# EAGLE design freeduino_V1.16-0805-WestfW (EAGLE 4.16)
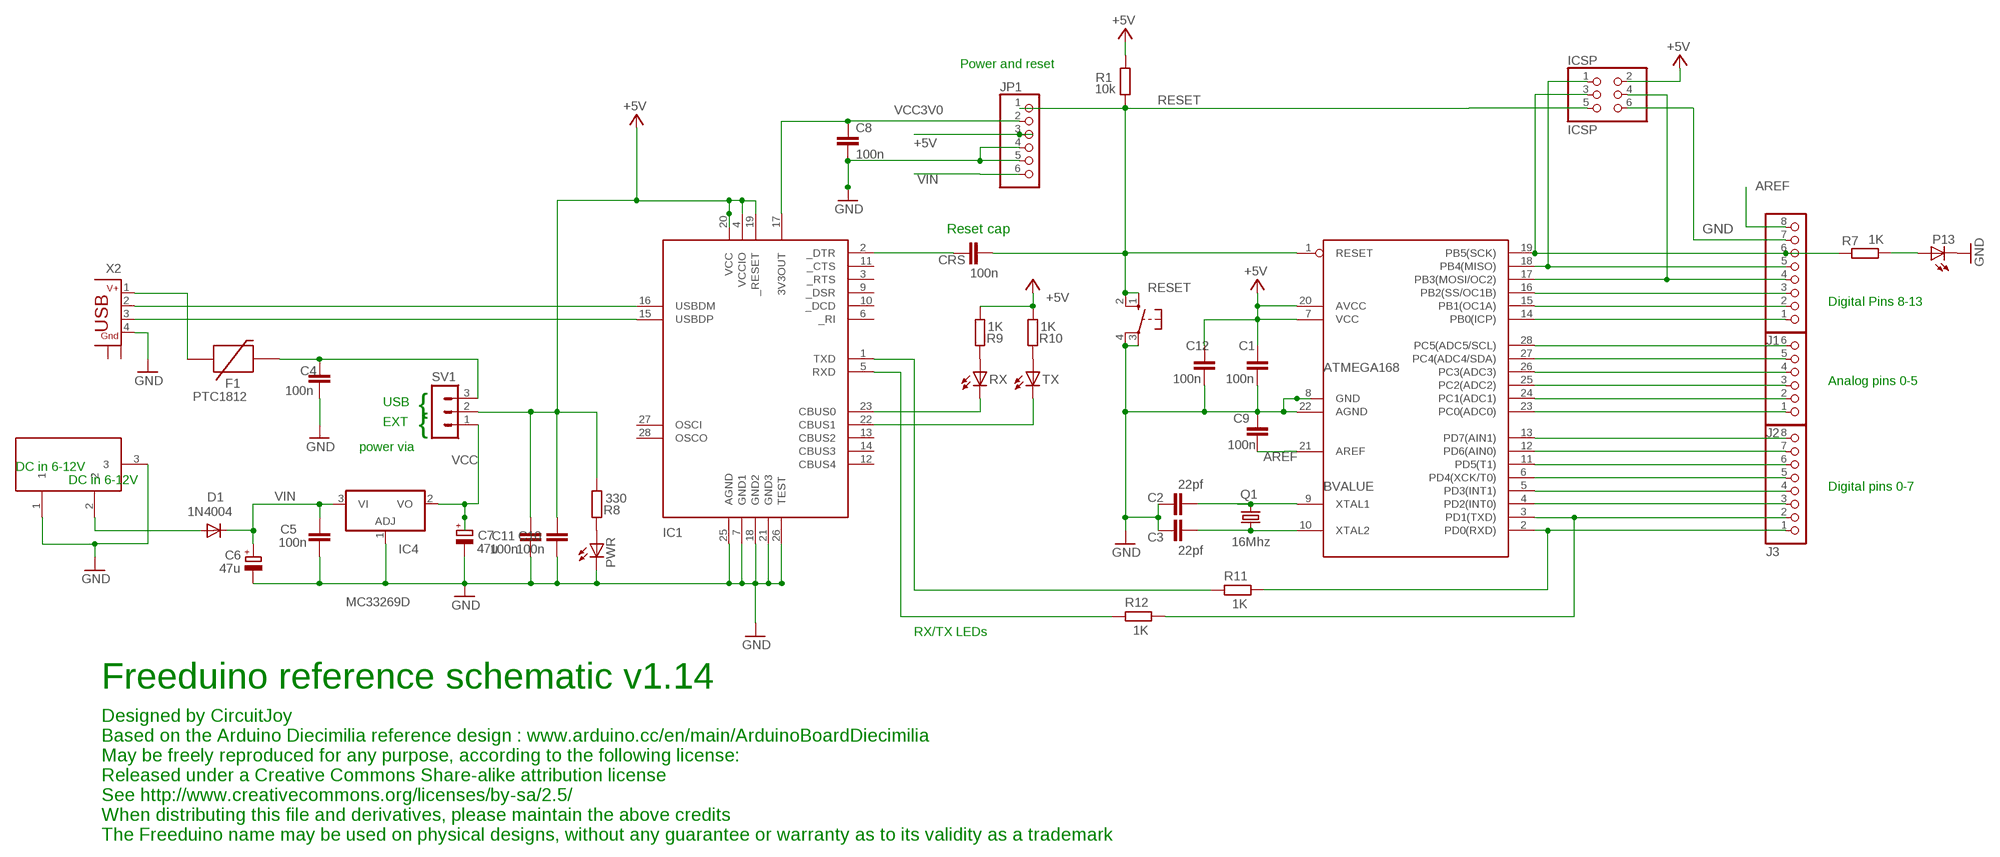
[diagram p0: schematic, sheet 1]

## Parts
BVALUE  ATMEGA168  MEGA8-P  [DIL28-3]
C1  100n  C-EUC0805  [C0805]
C2  22pf  C-EUC0805  [C0805]
C3  22pf  C-EUC0805  [C0805]
C4  100n  C-EUC0805  [C0805]
C5  100n  C-EUC0805  [C0805]
C6  47u  CPOL-EUD  [PANASONIC_D]
C7  47u  CPOL-EUD  [PANASONIC_D]
C8  100n  C-EUC0805  [C0805]
C9  100n  C-EUC0805  [C0805]
C10  100n  C-EUC0805  [C0805]
C11  100n  C-EUC1206  [C1206]
C12  100n  C-EUC0805  [C0805]
CRS  100n  C-EUC0805  [C0805]
D1  1N4004  DIODESMA  [SMA-DIODE]
DC1  9V in  DC21MMX  [DC-21MM]
F1  PTC1812  [C1812]
IC1  FT232RL  FT232RL-PINNED  [SSOP28DB]
IC4  MC33269D  [DPACK]
ICSP  ICSP  PINHD-2X3  [2X03]
J1  PINHD-1X8  [1X08]
J2  PINHD-1X6  [1X06]
J3  PINHD-1X8  [1X08]
JP1  PINHD-1X6  [1X06]
P13  LEDCHIPLED_0805  [CHIPLED_0805]
PWR  LEDCHIPLED_0805  [CHIPLED_0805]
Q1  16Mhz  CRYSTALHC49U-V  [HC49U-V]
R1  10k  R-EU_R0805  [R0805]
R7  1K  R-EU_R0805  [R0805]
R8  330  R-EU_R0805  [R0805]
R9  1K  R-EU_R0805  [R0805]
R10  1K  R-EU_R0805  [R0805]
R11  1K  R-EU_R0805  [R0805]
R12  1K  R-EU_R0805  [R0805]
RESET  10-XX  [B3F-10XX]
RX  LEDCHIPLED_0805  [CHIPLED_0805]
SV1  MA03-1  [MA03-1]
TX  LEDCHIPLED_0805  [CHIPLED_0805]
X2  CON-USB-B  [USB-WSHIELDPADS]

## Nets
+5V [power]: BVALUE.7(VCC) BVALUE.20(AVCC) C1.1 C10.2 C11.2 C12.1 IC1.4(VCCIO) IC1.19(_RESET) IC1.20(VCC) ICSP.2 JP1.3 R1.2 R8.1 R9.1 R10.1 SV1.2
AREF: BVALUE.21(AREF) C9.1 J1.8
GND [power]: BVALUE.8(GND) BVALUE.22(AGND) C1.2 C2.1 C3.1 C4.1 C5.1 C6.- C7.- C8.2 C9.2 C10.1 C11.1 C12.2 DC1.1 DC1.3 IC1.7(GND1) IC1.18(GND2) IC1.21(GND3) IC1.25(AGND) IC1.26(TEST) IC4.1(ADJ) ICSP.6 J1.7 JP1.4 JP1.5 P13.C PWR.C RESET.3(P) RESET.4(P1) X2.4
M8RXD [finepitch]: IC1.1(TXD) R11.1
M8TXD [finepitch]: IC1.5(RXD) R12.1
N$2: BVALUE.15(PB1(OC1A)) J1.2
N$3: PWR.A R8.2
N$5 [finepitch]: IC1.23(CBUS0) RX.C
N$6: BVALUE.9(XTAL1) C2.2 Q1.2
N$7 [power]: C4.2 F1.2 SV1.3
N$8: D1.A DC1.2
N$9 [finepitch]: IC1.16(USBDM) X2.2
N$10: BVALUE.4(PD2(INT0)) J3.3
N$11: BVALUE.5(PD3(INT1)) J3.4
N$12: BVALUE.6(PD4(XCK/T0)) J3.5
N$13: BVALUE.11(PD5(T1)) J3.6
N$14: BVALUE.12(PD6(AIN0)) J3.7
N$15: BVALUE.13(PD7(AIN1)) J3.8
N$16: BVALUE.23(PC0(ADC0)) J2.1
N$17: BVALUE.24(PC1(ADC1)) J2.2
N$18: BVALUE.25(PC2(ADC2)) J2.3
N$19: BVALUE.26(PC3(ADC3)) J2.4
N$20: BVALUE.27(PC4(ADC4/SDA)) J2.5
N$21: BVALUE.28(PC5(ADC5/SCL)) J2.6
N$22: BVALUE.3(PD1(TXD)) J3.2 R12.2
N$23: BVALUE.16(PB2(SS/OC1B)) J1.3
N$24 [finepitch]: IC1.15(USBDP) X2.3
N$26: BVALUE.18(PB4(MISO)) ICSP.1 J1.5
N$27 [power]: F1.1 X2.1
N$28: BVALUE.14(PB0(ICP)) J1.1
N$29 [finepitch]: IC1.22(CBUS1) TX.C
N$31: BVALUE.10(XTAL2) C3.2 Q1.1
N$32: P13.A R7.1
N$34: R10.2 TX.A
N$36: R9.2 RX.A
N$37 [finepitch]: CRS.1 IC1.2(_DTR)
N$43: BVALUE.17(PB3(MOSI/OC2)) ICSP.4 J1.4
N$44: BVALUE.2(PD0(RXD)) J3.1 R11.2
RESET: BVALUE.1(RESET) CRS.2 ICSP.5 JP1.1 R1.1 RESET.1(S) RESET.2(S1)
SCK: BVALUE.19(PB5(SCK)) ICSP.3 J1.6 R7.2
VCC [power]: C7.+ IC4.2(VO) SV1.1
VCC3V0 [power]: C8.1 IC1.17(3V3OUT) JP1.2
VIN [power]: C5.2 C6.+ D1.C IC4.3(VI) JP1.6
Unconnected: IC1.3(_RTS) IC1.6(_RI) IC1.9(_DSR) IC1.10(_DCD) IC1.11(_CTS) IC1.12(CBUS4) IC1.13(CBUS2) IC1.14(CBUS3) IC1.27(OSCI) IC1.28(OSCO)

## Notes on the sheet
- Power and reset
- Reset cap
- Digital Pins 8-13
- Analog pins 0-5
- USB
- {
- EXT
- {
- power via
- DC in 6-12V
- DC in 6-12V
- Digital pins 0-7
- RX/TX LEDs
- Freeduino reference schematic v1.14
- Designed by CircuitJoy
- Based on the Arduino Diecimilia reference design : www.arduino.cc/en/main/ArduinoBoardDiecimilia
- May be freely reproduced for any purpose, according to the following license:
- Released under a Creative Commons Share-alike attribution license
- See http://www.creativecommons.org/licenses/by-sa/2.5/
- When distributing this file and derivatives, please maintain the above credits
- The Freeduino name may be used on physical designs, without any guarantee or warranty as to its validity as a trademark

## Power pins joined to a net without a drawn wire
GND: X2.SH1(GND) X2.SH2(GND)

## Library data of the parts
BVALUE = my-library:MEGA8-P: MICROCONTROLLER 8 Kbytes FLASH 1 kbytes SRAM 512 bytes EEPROM USART 4-channel 10 bit ADC 2-channel 8 bit ADC Source: avr.lbr
C1-C5 C8-C12 CRS = rcl:C-EU: CAPACITOR, European symbol
C6 C7 = rcl:CPOL-EU: POLARIZED CAPACITOR, European symbol
D1 = SparkFunEagle-6-6-07:DIODE: Diode These are standard reverse protection diodes and small signal diodes. SMA package can handle up to about 1A. SOD-323 can handle about 200mA. What the SOD-323 package when ordering, there are some mfgs out there that are 5-pin packages.
DC1 = powersupply:DC21MM
F1 = SparkFunEagle-6-6-07:PTC: Resettable Fuse PTC Resettable Fuse. Spark Fun Electronics SKU : COM-08357
IC1 = my-library:FT232RL-PINNED: USB UART FT232RL 4th Generation USB UART (USB <-> Serial) Controller. Spark Fun Electronics SKU : COM-00650
IC4 = linear:MC33269?*: Adjustable Output Low Dropout Voltage Regulator 800 mA Source: http://www.onsemi.com/pub/Collateral/MC33269-D.PDF
ICSP = pinhead:PINHD-2X3: PIN HEADER
J1 J3 = pinhead:PINHD-1X8: PIN HEADER
J2 JP1 = pinhead:PINHD-1X6: PIN HEADER
P13 PWR RX TX = led:LED: LED OSRAM: - CHIPLED LG R971, LG N971, LY N971, LG Q971, LY Q971, LO R971, LY R971 LH N974, LH R974 LS Q976, LO Q976, LY Q976 LO Q996 - Hyper CHIPLED LW Q18S LB Q993, LB Q99A, LB R99A - SideLED LS A670, LO A670, LY A670, LG A670, LP A670 LB A673, LV A673, LT A673, LW A673 LH A674 LY A675 LS A676, LA A676, LO A676, LY A676, LW A676 LS A679, LY A679, LG A679 - Hyper Micro SIDELED® LS Y876, LA Y876, LO Y876, LY Y876 LT Y87S - SmartLED LW L88C, LW L88S LB L89C, LB L89S, LG L890 LS L89K, LO L89K, LY L89K LS L896, LA L896, LO L896, LY L896 - TOPLED LS T670, LO T670, LY T670, LG T670, LP T670 LSG T670, LSP T670, LSY T670, LOP T670, LYG T670 LG T671, LOG T671, LSG T671 LB T673, LV T673, LT T673, LW T673 LH T674 LS T676, LA T676, LO T676, LY T676, LB T676, LH T676, LSB T676, LW T676 LB T67C, LV T67C, LT T67C, LS T67K, LO T67K, LY T67K, LW E67C LS E67B, LA E67B, LO E67B, LY E67B, LB E67C, LV E67C, LT E67C LW T67C LS T679, LY T679, LG T679 LS T770, LO T770, LY T770, LG T770, LP T770 LB T773, LV T773, LT T773, LW T773 LH T774 LS E675, LA E675, LY E675, LS T675 LS T776, LA T776, LO T776, LY T776, LB T776 LHGB T686 LT T68C, LB T68C - Hyper Mini TOPLED® LB M676 - Mini TOPLED Santana® LG M470 LS M47K, LO M47K, LY M47K Source: http://www.osram.convergy.de/
Q1 = crystal:CRYSTAL: CRYSTAL
R1 R7-R12 = rcl:R-EU_: RESISTOR, European symbol
RESET = switch-omron:10-XX: OMRON SWITCH
SV1 = con-lstb:MA03-1: PIN HEADER
X2 = mylib4:CON-USB-B: BERG USB connector

## Net classes
0 default: width 0.254 mm, drill 0.203 mm
1 power: width 0.508 mm, drill 0.305 mm
2 finepitch: width 0.203 mm, drill 0.203 mm

## Board
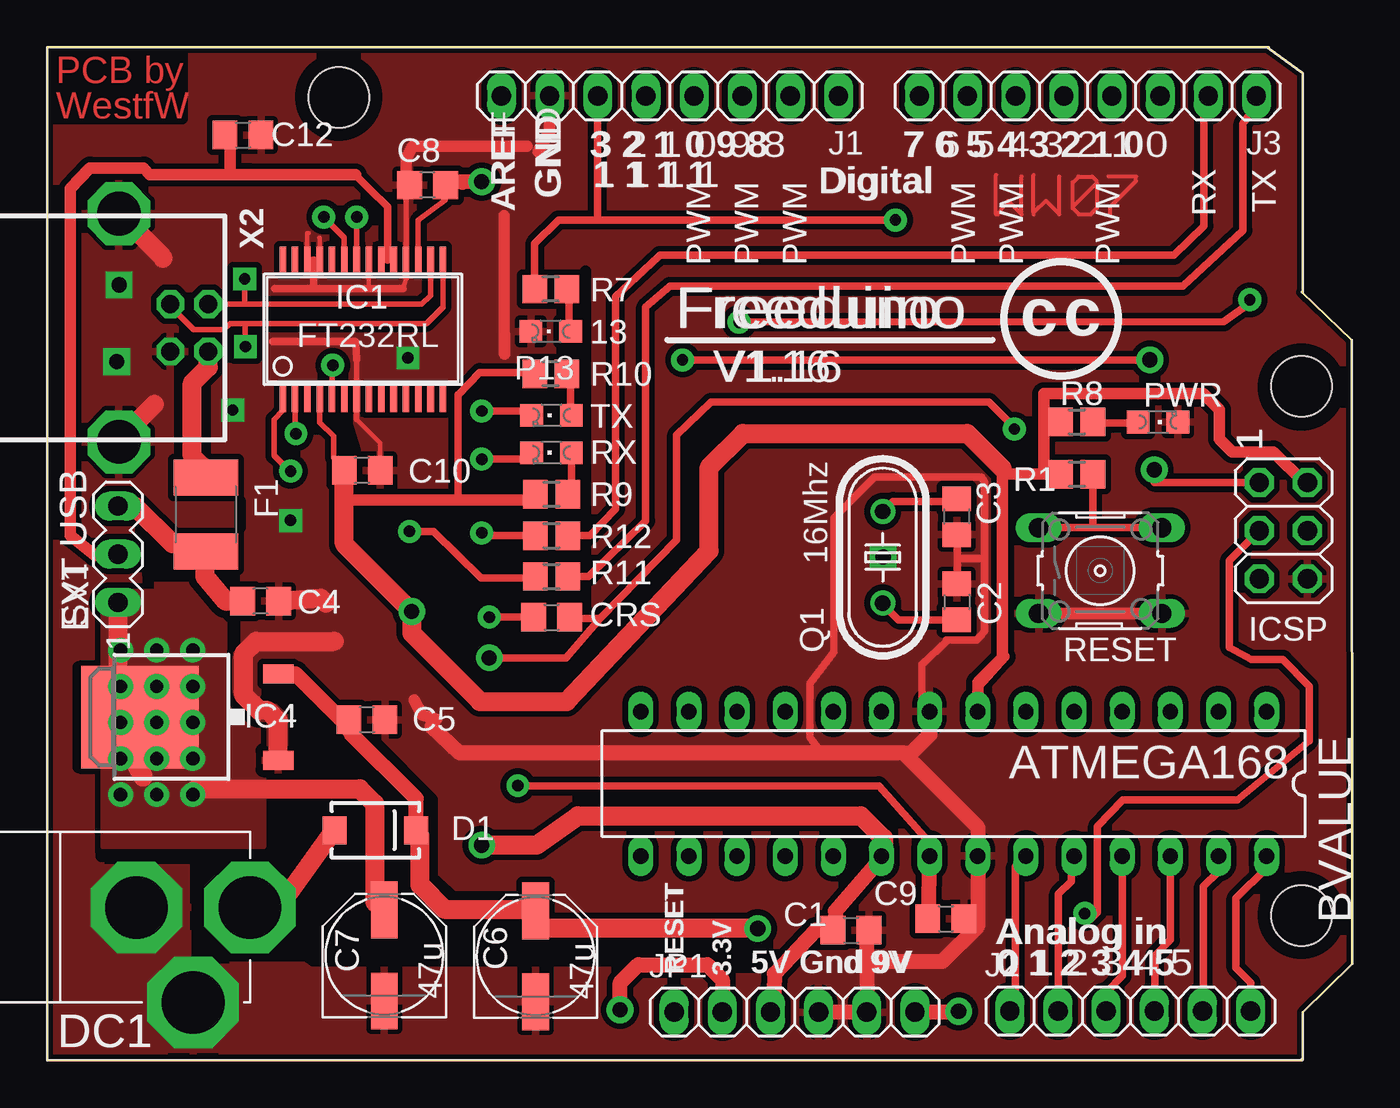
[diagram p1: board, top side]
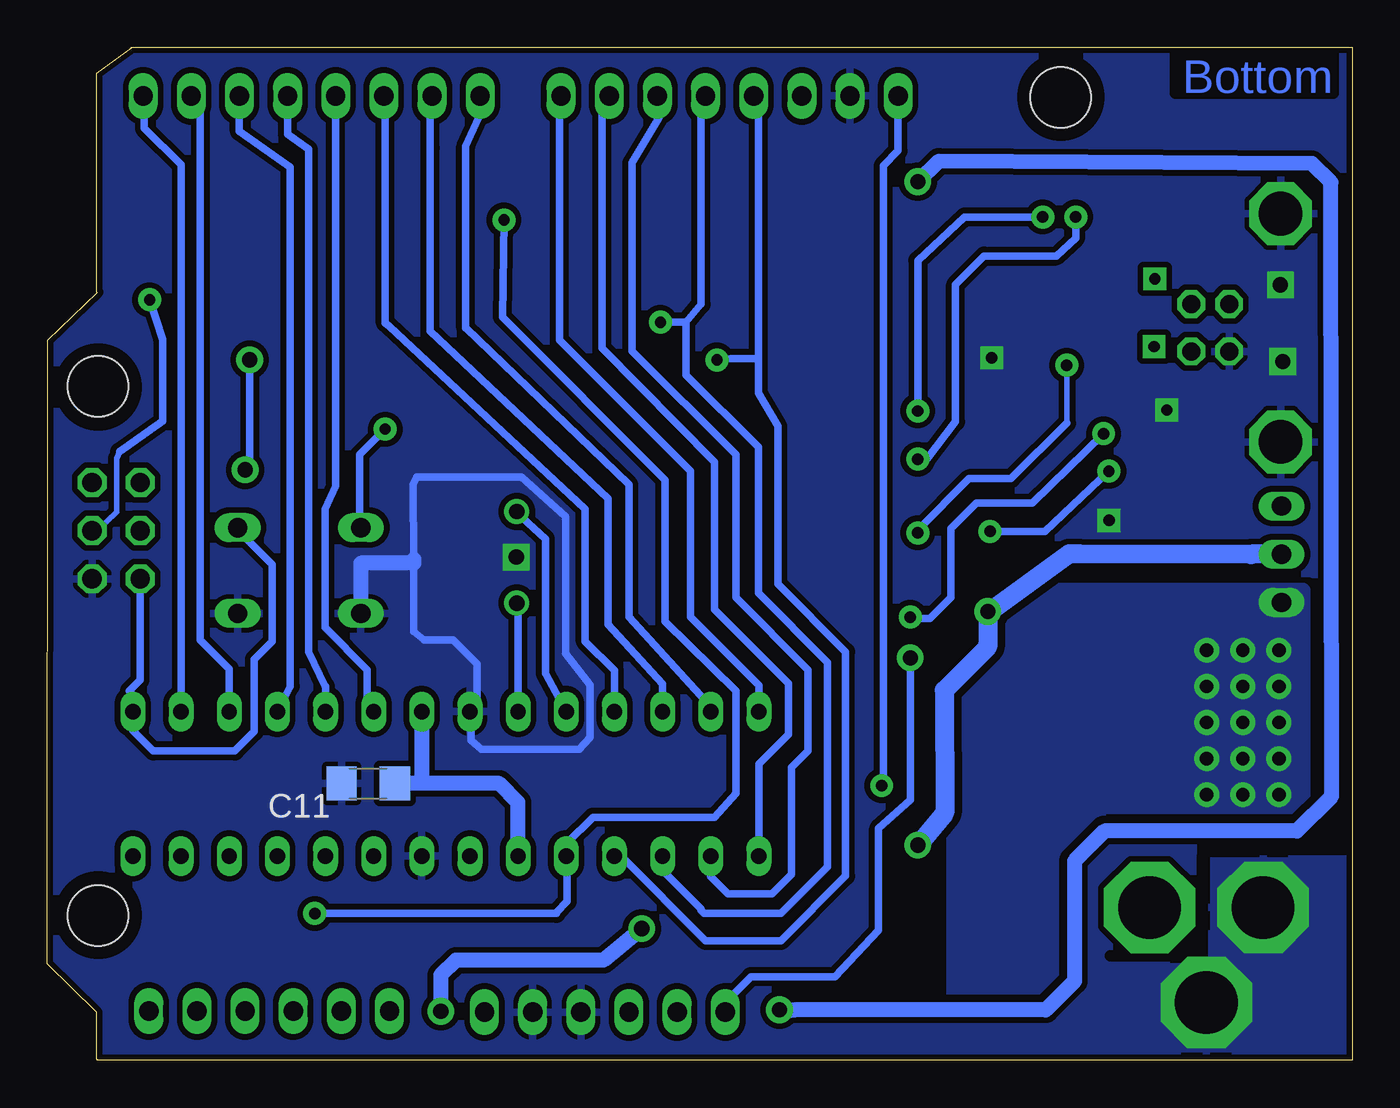
[diagram p2: board, bottom side, seen from below]

Size 68.83 x 53.44 mm. Coordinates in mm from the lower left corner, seen from the top.
Outline: 66.2,0.03 66.22,0.06 66.22,2.55 68.83,5.1
Outline: 66.22,40.54 66.22,52.09 64.39,53.44
Outline: 66.18,0.05 66.2,0 63.63,0.01 0,0.01 0,53.44 64.44,53.44
Outline: 68.83,5.11 68.81,38 66.17,40.54
Copper layers (1*16): Top 0.035mm / dielectric 1.5mm / Bottom 0.035mm
Design rules "default": minimum track width 10mil, minimum drill 0.6mm, track to track 8mil, track to pad 8mil, pad to pad 8mil, via to via 12mil, smd to smd 8mil, copper to edge 10mil, drill to drill 15mil, minimum pad ring 10mil, minimum via ring 12mil, stop-mask expansion 4mil, vias tented up to drill 0mil, thermal gap 10mil
Holes 3.2 mm at 66.17,35.57 66.17,7.63 15.37,50.81
tRestrict: area 13.5,48.9 to 17.3,52.7; area 64.3,33.6 to 68,37.4; area 64.3,5.8 to 68,9.6; 26 lines
bRestrict: area 13.5,48.9 to 17.3,52.7; area 64.3,33.6 to 68,37.4; area 64.3,5.8 to 68,9.6; 3 lines

### Footprints (pad centres in the part's own frame; a part is rotated, then mirrored left to right if it is on the bottom)
DIL28-3 = drill 0.813 long: 1 -16.51,-3.81; 2 -13.97,-3.81; 3 -11.43,-3.81; 4 -8.89,-3.81; 5 -6.35,-3.81; 6 -3.81,-3.81; 7 -1.27,-3.81; 8 1.27,-3.81; 9 3.81,-3.81; 10 6.35,-3.81; 11 8.89,-3.81; 12 11.43,-3.81; 13 13.97,-3.81; 14 16.51,-3.81; 15 16.51,3.81; 16 13.97,3.81; 17 11.43,3.81; 18 8.89,3.81; 19 6.35,3.81; 20 3.81,3.81; 21 1.27,3.81; 22 -1.27,3.81; 23 -3.81,3.81; 24 -6.35,3.81; 25 -8.89,3.81; 26 -11.43,3.81; 27 -13.97,3.81; 28 -16.51,3.81
C0805 = smd 1.3 x 1.5: 1 -0.95,0; 2 0.95,0
PANASONIC_D = smd 3 x 1.4: + 2.4,0; - -2.4,0
C1206 = smd 1.6 x 1.8: 1 -1.4,0; 2 1.4,0
SMA-DIODE = smd 1.27 x 1.47: A -2.15,0; C 2.15,0
DC-21MM = drill 3.302 pad 4.826 octagon: 1 -5.08,-3.353; 2 -0.076,-6.35; 3 -0.076,-0.356
C1812 = smd 1.9 x 3.4: 1 -1.95,0; 2 1.95,0
SSOP28DB = smd 0.348 x 1.397: 1 -4.225,-3.656; 2 -3.575,-3.656; 3 -2.925,-3.656; 4 -2.275,-3.656; 5 -1.625,-3.656; 6 -0.975,-3.656; 7 -0.325,-3.656; 8 0.325,-3.656; 9 0.975,-3.656; 10 1.625,-3.656; 11 2.275,-3.656; 12 2.925,-3.656; 13 3.575,-3.656; 14 4.225,-3.656; 15 4.225,3.656; 16 3.575,3.656; 17 2.925,3.656; 18 2.275,3.656; 19 1.625,3.656; 20 0.975,3.656; 21 0.325,3.656; 22 -0.325,3.656; 23 -0.975,3.656; 24 -1.625,3.656; 25 -2.275,3.656; 26 -2.925,3.656; 27 -3.575,3.656; 28 -4.225,3.656
DPACK = smd 1 x 1.6: 1 -2.28,-4.8; 3 2.28,-4.8 | smd 5.4 x 6.2: 2 0,2.5
2X03 = drill 1.016 octagon: 1 -2.54,-1.27; 2 -2.54,1.27; 3 0,-1.27; 4 0,1.27; 5 2.54,-1.27; 6 2.54,1.27
1X08 = drill 1.016 long: 1 -8.89,0; 2 -6.35,0; 3 -3.81,0; 4 -1.27,0; 5 1.27,0; 6 3.81,0; 7 6.35,0; 8 8.89,0
1X06 = drill 1.016 long: 1 -6.35,0; 2 -3.81,0; 3 -1.27,0; 4 1.27,0; 5 3.81,0; 6 6.35,0
CHIPLED_0805 = smd 1.2 x 1.2: A 0,-1.05; C 0,1.05
HC49U-V = drill 0.813 round: 1 -2.413,0; 2 2.413,0
R0805 = smd 1.3 x 1.5: 1 -0.85,0; 2 0.85,0
B3F-10XX = drill 1.016 long: 1 -3.251,2.261; 2 3.251,2.261; 3 -3.251,-2.261; 4 3.251,-2.261
MA03-1 = drill 1.016 long: 1 -2.54,0; 2 0,0; 3 2.54,0
USB-WSHIELDPADS = drill 0.95 octagon: 1 1.25,4.71; 2 -1.25,4.71; 3 -1.25,2.71; 4 1.25,2.71 | drill 2.3 octagon: SH1 -6.02,0; SH2 6.02,0

### Placement (x,y rotation side)
BVALUE  47.81,14.59 180 top
C1  42.39,6.87 0 top
C2  47.97,24.19 270 top
C3  47.98,28.68 90 top
C4  11.25,24.23 180 top
C5  16.85,17.97 180 top
C6  25.75,5.49 90 top
C7  17.77,5.53 90 top
C8  20.06,46.17 180 top
C9  47.39,7.47 0 top
C10  16.61,31.13 180 top
C11  51.9,14.61 0 bottom
C12  10.32,48.82 0 top
CRS  26.59,23.38 0 top
D1  17.31,12.14 0 top
DC1  4.34,8.14 90 top
F1  8.36,28.81 270 top
IC1  16.64,38.57 0 top
IC4  7.38,18.12 90 top
ICSP  65.2,27.95 270 top
J1  32.84,50.88 180 top
J2  57.12,2.6 0 top
J3  54.89,50.88 180 top
JP1  39.42,2.55 0 top
P13  26.55,38.46 90 top
PWR  58.59,33.68 270 top
Q1  44.07,26.54 270 top
R1  54.3,30.92 180 top
R7  26.55,40.69 180 top
R8  54.3,33.68 0 top
R9  26.59,29.87 0 top
R10  26.55,36.23 0 top
R11  26.59,25.53 0 top
R12  26.59,27.68 0 top
RESET  55.54,25.84 0 top
RX  26.59,32.06 90 top
SV1  3.72,26.7 90 top
TX  26.59,34.04 90 top
U$3  [CC-LOGO]  54.37,39.73 0 top
X2  3.77,38.65 270 top

### Tracks (layer width: path | path; a pad name or v marks a point on that pad's centre or on a via)
+5V  (via drill 0.8)
  Top 0.25: 17.95,42.23 18.2,42.23 18.23,42.26 IC1.19 17.95,42.23 | 17.95,42.23 IC1.20 | SV1.2 3.7,26.72 3.62,26.64 | 17.04,45.92
  Top 0.3: IC1.4 14.36,33.66 15.09,32.94 15.09,31.81 15.66,31.23 C10.2
  Top 0.4: 17.95,42.23 17.95,45.05 17.04,45.92 16.24,46.72 | 25.77,36.29 25.82,36.29 | 25.77,36.29 R10.1 | 25.77,36.29 22.8,36.29 21.68,35.13 21.65,35.13 21.65,29.56 21.63,29.52
  Top 0.6: 9.65,46.72 5.39,46.72 5.09,47.08 2.23,47.08 1.2,45.98 1.2,43.05 1.2,42.79 1.2,27.69 2.51,26.64 3.62,26.64 | 9.65,46.72 10.65,46.72 | 10.65,46.72 16.24,46.72 16.25,46.72 | 49.08,19.78 BVALUE.7 | 49.08,19.78 49.08,19.94 50.37,21.24 50.37,30.92 | 52.56,30.92 53.18,30.92 | 52.56,30.92 52.56,33.82 | 52.56,33.82 52.56,35.17 60.98,35.17 61.82,34.32 61.82,32.78 62.5,32.1 64.68,32.1 66.3,30.49 ICSP.2 | R8.1 53.35,33.78 52.56,33.82 | 53.18,30.92 53.19,30.92 | 53.18,30.92 53.01,31.09 | 49.08,19.78 50.47,21.3 | 10.65,46.72 10.65,46.73 | 50.37,31.23 50.37,30.92 | 50.37,30.92 52.56,30.92 | 52.56,30.92 R1.2 | C12.1 9.65,48.54 9.65,46.72 | 25.74,29.56 25.84,29.56 | 25.74,29.56 R9.1 | 15.66,29.56 21.65,29.56 25.74,29.56
  Top 0.8: JP1.3 38.15,2.51 38.31,2.66 38.35,4.57 40.53,6.87 C1.1 41.54,6.9 41.4,7.03 41.56,7.19 41.56,7.86 44,10.66 BVALUE.20 44,10.81 44.1,10.92 | R1.2
  Top 1: v22.91,11.36 25.83,11.36 27.99,12.9 42.91,12.9 44.1,11.71 44.1,10.92 | 50.37,31.23 48.52,33.08 36.69,33.08 34.91,31.29 34.91,26.89 27.4,18.94 | C10.2 15.66,29.56 15.66,27.24 v19.22,23.69 v19.22,23.68 19.25,23.68 19.29,23.63 19.21,23.55 19.21,22.54 22.82,18.93 27.39,18.93 27.4,18.94 | 27.4,18.94 27.41,18.95
  Bottom 0.8: v22.92,11.36 v22.91,11.36 | C11.2 44.98,14.61 44,13.62 44,10.8 43.97,10.78 | 43.97,10.78 43.96,10.76 | BVALUE.20 43.97,10.78 | BVALUE.7 49.08,14.62
  Bottom 1: v22.92,11.36 21.48,13.06 21.52,19.53 19.22,21.82 19.22,21.94 19.21,21.95 19.22,21.95 v19.22,23.68 19.22,23.62 19.21,23.61 14.94,26.72 14.39,26.72 5.34,26.69 5.33,26.68 5.31,26.7 SV1.2
AREF  (via drill 0.6)
  Top 0.4: v24.82,14.49 43.87,14.49 46.48,11.55 46.48,10.76 46.54,10.71 | 46.54,10.71 46.56,10.68 | 46.54,10.71 BVALUE.21
  Top 0.8: 46.54,10.9 46.54,10.89 BVALUE.21 | 46.54,10.9 C9.1 | 46.54,10.9 46.56,10.92
  Bottom 0.4: J1.8 23.95,47.98 24.74,47.2 24.74,14.57 v24.82,14.49 | v24.82,14.49 24.97,14.57 | v24.82,14.49
GND  (via drill 0.6, 0.8)
  Top 0.2: 50.04,46.7 50.04,44.64 50.12,44.64 50.68,45.35 51.39,44.64 51.39,46.62 | 52.02,44.72 52.02,46.7 | 52.02,44.72 52.02,44.64 | 52.66,45.35 52.02,44.72 | 52.66,45.35 | 52.66,45.35 53.37,44.64 53.37,46.62 | 55.99,46.62 57.42,46.62 57.42,46.39 | 57.42,46.39 | 57.42,46.39 56.07,45.04 56.07,44.64 | 54.09,44.96 54.09,46.31 54.41,46.62 55.12,46.62 55.36,46.39 55.36,46.31 | 55.36,46.31 55.36,44.96 55.04,44.64 54.41,44.64 54.09,44.96 | 54.09,44.96 54.09,45.04 55.36,46.31
  Top 0.25: 13.71,42.25 13.71,42.26 | IC1.26 13.71,42.25 | 14.05,42.23 13.74,42.23 13.71,42.25 | 14.05,42.23 IC1.25 14.36,43.4 14.34,43.4 | 18.78,40.71 18.91,41.24 | 14.05,42.23 IC1.26 | IC1.21 16.96,40.71 | 18.91,46.19 18.93,46.18 C8.2 18.88,46.17 18.85,46.14 18.91,46.07 18.91,46.19 | 18.91,46.19 18.86,46.24 | IC1.26 13.71,43.64 13.79,43.64 | 16.31,33.8 17.56,32.56 17.56,31.17 C10.1
  Top 0.3: 16.31,36.97 IC1.7 16.31,33.8 | 18.91,41.24 IC1.18 18.91,46.07
  Top 0.4: 16.31,36.97 16.25,37.91 11.89,37.91 | 11.98,40.71 14.05,40.71 | 14.05,40.71 16.96,40.71 18.78,40.71 | 14.05,40.71 14.05,42.23 | C3.1 48.01,27.67 47.99,27.67 47.99,25.06 | 47.99,25.06 C2.1 | 49.42,26.48 49.42,30.53 49.26,30.76 43.63,30.76 41.48,28.62 41.48,21.56 40.21,19.89 40.21,17.03 40.69,16.4 45.85,16.4 | 49.42,26.48 49.42,22.63 49.02,22.19 47.44,22.19 47.44,22.1 46.14,20.89 46.14,18.98 46.53,18.4 BVALUE.8 | 45.85,16.4 46.01,16.4 46.56,16.95 46.56,18.3 46.56,18.46 | 47.99,25.06 47.99,26.48 49.42,26.48 | 45.77,16.56 45.85,16.56 45.85,16.4
  Top 0.6: 24.11,37.27 24.1,39.49 24.1,44.57 | 25.89,47.95 26.48,49.02 26.48,50.77 | 18.91,46.07 18.91,47.56 19.26,48.23 25.29,48.23 | JP1.5 43.35,2.55 | RESET.3 RESET.4 | 19.33,19.01 19.77,18.22 20.52,17.98
  Top 0.8: 49.08,7.35 49.08,7.08 47.2,5.2 44.5,5.2 | 49.08,7.35 BVALUE.22 49.08,12.3 45.37,16 | 44.5,5.2 43.23,5.28 43.23,5.2 | 43.23,5.2 43.23,2.66 43.31,2.59 43.27,2.55 JP1.5 43.11,2.55 43.07,2.59 43.03,2.55 JP1.4 | 44.5,5.2 43.23,5.2 | C1.2 43.24,6.39 43.23,5.2 | 49.08,7.35 48.95,7.35 48.82,7.47 C9.2 | 45.37,16 45.14,16.24 21.72,16.24 20.27,17.61 | 45.37,16 45.35,16 | 45.37,16 | 46.56,18.3 46.56,17.19 45.37,16
  Top 1: IC4.1 12.18,17.91 11.64,18.45 11.16,18.45 10.37,19.25 10.37,21.47 11,22.1 15.13,22.1 | C4.1 14.43,24.39 14.69,24.13 14.69,24.17 | 3.76,44.68 6.1,42.34 6.1,42.32 | 3.74,32.7 5.64,34.6 | 3.74,32.7 3.82,32.7 3.82,32.67 X2.SH2 | 3.74,32.7 3.7,32.66
  Bottom 0.4: BVALUE.8 46.54,18.65 46.17,19.02 46.17,20.92 47.44,22.19 48.95,22.19 49.5,22.63 49.5,26.45 49.54,30.37 49.34,30.76 43.83,30.76 41.48,28.7 41.48,21.48 40.21,19.81 40.21,17.03 40.77,16.4 45.93,16.4 46.48,16.87 46.48,18.3 46.56,18.38 46.72,18.38
  Bottom 0.8: RESET.3 52.29,26.24 49.5,26.24 49.5,26.45
  other vias: 44.09,26.55 3.78,40.91 3.66,36.86 12.83,28.49 19.02,37.06 9.77,34.3
  pour Top (isolate 0.305, rank 4): -0.9,54.58 -0.9,-0.99 70.46,-0.99 70.46,54.58 -0.9,54.58
  pour Bottom (isolate 0.305, rank 4): -7.05,54.38 -7.01,-0.43 69.82,-0.43 69.82,54.58 -7.01,54.62
  pour Top (isolate 0.4, rank 5, no thermals): 2.11,12.11 2.11,-0.43 11.16,-0.43 11.16,12.11
  pour Bottom (isolate 0.4, rank 6, no thermals): 0.13,10.44 0.13,-0.11 12.83,-0.11 12.83,10.44
M8RXD  (via drill 0.6)
  Top 0.25: 25.69,25.45 25.73,25.41 R11.1
  Top 0.3: IC1.1 12.41,34.27 11.95,33.81 11.95,31.9 12.83,31.03 12.83,31.04 v12.83,31.08
  Top 0.4: v19.1,27.91 19.58,27.91 20.37,27.91 22.87,25.45 25.69,25.45
  Bottom 0.4: v12.83,31.08 16.2,27.91 v19.1,27.91
M8TXD  (via drill 0.6)
  Top 0.3: v15.05,36.68 15.05,36.7 15.05,36.71 15.01,36.67 IC1.5
  Top 0.4: R12.1 23.5,27.68 v22.91,27.83
  Bottom 0.3: 15.05,36.48 15.05,33.62
  Bottom 0.4: v22.91,27.83 22.91,27.99 20.21,30.68 17.99,30.68 15.05,33.62 | v15.05,36.68 15.09,36.56 15.05,36.48
N$2
  Bottom 0.4: BVALUE.15 31.3,15.63 29.74,17.19 29.74,19.89 33.63,23.78 33.63,31.56 39.58,37.59 39.58,50.05 39.66,50.21 39.19,50.68 J1.2 39.14,50.88 39.1,50.92
N$3
  Top 0.4: R8.2 55.37,33.62 57.84,33.62 PWR.A
N$5  (via drill 0.6)
  Top 0.3: IC1.23 15.66,43.41 v14.58,44.5
  Top 0.4: v22.91,31.72 v22.92,31.72 22.92,31.73 25.21,31.73 RX.C
  Bottom 0.25: v14.58,44.5
  Bottom 0.4: v22.91,31.72 22.43,31.72 20.93,33.7 20.93,40.92 19.42,42.43 15.61,42.43 14.58,43.38 v14.58,44.5
N$6
  Top 0.4: Q1.2 44.04,24.1 44.9,23.24 C2.2
  Bottom 0.4: 44.07,24.18 44.1,24.18 | 44.07,24.18 Q1.2 | BVALUE.9 44,24.18 44.07,24.18
N$7
  Top 1: SV1.3 4.62,29.24 6.6,27.26 8.06,27.26 8.36,26.97 F1.2 8.33,26.86 8.3,26.83 8.3,25.52 9.41,24.21 C4.2
N$8
  Top 0.8: 15.16,12.22 D1.A
  Top 1: DC1.2 11.96,8.06 12.79,8.89 15.17,12.23 15.16,12.22
N$9  (via drill 0.6)
  Top 0.3: X2.2 10.41,39.9 | 10.41,39.9 19.75,39.9 20.21,40.36 IC1.16 | 10.41,39.9 v10.41,41.23
N$10
  Bottom 0.4: J3.3 58.7,49.01 56.01,47.11 56.01,19.73 56.67,18.42 56.66,18.43 56.64,18.44 BVALUE.4
N$11
  Bottom 0.4: J3.4 56.16,48.85 55.06,48.07 55.05,21.55 54.18,19.73 54.17,19.73 54.16,19.74 54.16,19.73 BVALUE.5
N$12
  Bottom 0.4: J3.5 53.62,30.3 54.18,29.1 54.18,22.83 51.96,20.6 51.96,19.02 51.97,19.02 | 51.97,19.02 51.98,19.02 | BVALUE.6 51.62,18.38 51.97,19.02
N$13
  Bottom 0.4: BVALUE.11 38.92,20.58 40.45,22.11 40.45,29.1 50.81,38.74 51.01,38.9 51.01,50.77 51.08,50.84 J3.6
N$14
  Bottom 0.4: BVALUE.12 36.38,19.86 39.26,22.98 39.26,29.65 48.63,38.46 48.63,48.15 48.63,49.89 48.55,50.92 48.55,50.85 | 48.54,50.92 J3.7 48.54,50.85 48.55,50.85 | 48.55,50.85
N$15
  Bottom 0.4: BVALUE.13 33.84,18.67 38.15,23.38 38.15,30.37 46.76,38.66 46.76,38.62 46.76,48.23 46.09,49.73 46.09,50.69 46,50.78 J3.8
N$16
  Top 0.4: J2.1 51.07,2.9 51.07,10.23 BVALUE.23
N$17
  Top 0.4: BVALUE.24 54.01,10.63 54.01,9.45 53.33,8.77 53.33,2.58 J2.2
N$18
  Top 0.4: BVALUE.25 56.71,4.45 55.91,3.66 55.91,2.58 55.87,2.58 J2.3
N$19
  Top 0.4: BVALUE.26 59.25,6.35 58.41,5.52 58.41,2.62 J2.4
N$20
  Top 0.4: BVALUE.27 61.78,9.96 60.99,9.17 60.99,3.02 60.93,2.96 J2.5
N$21
  Top 0.4: BVALUE.28 64.32,10.16 62.7,8.54 62.7,4.89 63.49,4.09 63.49,2.62 63.47,2.61 J2.6
N$22
  Top 0.4: R12.2 28.63,27.68 29.97,29.1 29.97,40.29 32.25,42.41 32.32,42.47 59.42,42.47 61.01,44.02 61.01,50.45 61.33,50.77 61.24,50.85 J3.2
  Bottom 0.4: BVALUE.3 59.24,20.66 60.77,22.19 60.77,50.37 61.29,50.88 | 61.29,50.88 61.41,51 | J3.2 61.29,50.88
N$23
  Bottom 0.4: BVALUE.16 33.84,9.7 32.91,8.78 30.61,8.78 29.58,9.81 29.58,15.44 28.7,16.32 28.7,20.6 32.51,24.41 32.51,31.95 37.99,37.43 37.99,47.35 36.56,49.73 36.56,50.69 36.65,50.78 J1.3
N$24  (via drill 0.6)
  Top 0.25: 6.48,39.78 6.49,39.79
  Top 0.3: 10.45,38.88 9.65,38.88 9.29,38.55 7.71,38.55 6.48,39.78 6.48,39.84 6.48,39.85 X2.3 | 10.45,38.88 v10.45,37.66 | 10.45,38.88 20,38.88 20.86,39.74 IC1.15
N$26  (via drill 0.6, 0.8)
  Top 0.4: ICSP.1 58.39,30.49 v58.39,31.16 | v33.51,36.95 v58.15,36.95
  Bottom 0.4: v58.39,31.16 58.15,31.16 v58.15,36.95 | BVALUE.18 38.57,10.78 34.1,6.32 30.13,6.32 26.72,9.73 26.72,21.56 30.29,25.13 30.29,33.46 31.32,35.21 31.32,37.03 | J1.5 31.52,50.88 31.4,50.77 31.32,50.13 31.32,37.03 | v33.51,36.95 32.75,37.03 31.32,37.03
N$27
  Top 1: 8.49,30.98 8.34,30.83 8.36,30.82 F1.1 8.3,30.76 8.26,30.79 8.48,31.02 8.48,31.03 7.65,31.87 7.65,35.73 8.48,36.57 X2.1
N$28
  Bottom 0.4: BVALUE.14 31.3,19.78 34.9,23.38 34.9,31.08 41.8,37.99 41.8,50.85 41.73,50.92 | 41.73,50.92 41.72,50.92 | 41.73,50.92 J1.1
N$29  (via drill 0.6)
  Top 0.25: 16.32,42.19 16.31,42.2 IC1.22
  Top 0.3: 16.32,42.19 v16.32,44.5
  Top 0.4: v22.91,34.26 22.92,34.27 25.31,34.27 TX.C
  Bottom 0.4: v22.91,34.26 22.91,42.19 20.45,44.5 16.48,44.5 v16.32,44.5
N$31
  Top 0.4: 48.21,29.49 48.23,29.49 | 48.21,29.49 C3.2 | Q1.1 44.61,29.49 48.21,29.49
  Bottom 0.4: BVALUE.10 42.56,20.41 42.56,27.51 44.1,28.94 44.1,28.92 Q1.1
N$32
  Top 0.4: P13.A arc90 27.59,38.48 27.52,38.48 27.52,40.57 arc90 R7.1
N$34
  Top 0.4: TX.A arc90 27.61,34.07 27.6,34.07 27.6,36.03 arc90 R10.2
N$36
  Top 0.4: R9.2 27.44,29.94 27.64,29.94 RX.A
N$37  (via drill 0.6)
  Top 0.25: 25.74,23.38 arc-90 CRS.1 | 13.07,35.05 IC1.2 | v13.11,33.07 13.07,33.22
  Top 0.3: 13.07,33.22 IC1.2
  Top 0.4: v23.31,23.38 25.74,23.38
  Bottom 0.4: v13.11,33.07 16.88,29.41 19.81,29.41 21.16,28.06 21.16,24.41 22.28,23.3 23.31,23.3 v23.31,23.38
N$43  (via drill 0.6)
  Top 0.4: v63.43,40.13 63.43,39.94 62.06,38.97 37.12,38.94 v36.48,38.94
  Bottom 0.2: 66.49,27.91 66.49,27.93
  Bottom 0.3: 65.02,32.11 65.18,31.76 65.18,28.94 66.25,27.91 66.49,27.91 | 66.49,27.93 ICSP.4
  Bottom 0.4: BVALUE.17 36.38,10.02 34.34,7.98 34.34,7.9 34.18,7.74 30.13,7.74 27.67,10.21 27.67,21 31.32,24.65 31.32,32.35 35.13,36.16 35.13,38.94 | J1.4 33.98,50.88 33.86,50.77 34.34,50.05 34.34,39.89 35.13,38.94 | 65.02,32.11 62.76,33.74 62.76,38.03 v63.43,40.13 | 35.13,38.94 v36.48,38.94
N$44
  Top 0.4: R11.2 28.55,25.53 31.56,28.46 31.56,39.73 32.83,40.84 59.9,40.84 63.07,43.78 63.07,49.42 64.03,50.77 63.91,50.88 J3.1
  Bottom 0.4: BVALUE.2 61.78,47.25 63.71,49.18 63.71,50.61 63.79,50.69 63.78,50.7 J3.1
RESET  (via drill 0.6, 0.8)
  Top 0.4: CRS.2 27.44,23.31 27.43,23.3 29.14,23.3 | RESET.1 55.22,28.1 | 55.22,28.1 58.44,28.1 58.63,27.91 58.79,28.07 RESET.2 58.87,28.06 | 55.22,28.1 55.22,28.14 55.15,28.21 R1.1 | v23.31,21.24 27.36,21.24 29.14,23.3 | 29.14,23.3 33.2,27.44 33.2,33 35,34.72 49.67,34.72 51.01,33.38 v51.01,33.3
  Bottom 0.4: ICSP.5 63.93,20.06 64.5,19.49 64.32,19.31 BVALUE.1 64.32,17.4 63.23,16.32 58.95,16.32 57.91,17.35 57.91,21.16 56.96,22.11 56.96,26.16 58.79,27.99 RESET.2 | RESET.1 52.34,28.14 52.36,28.14 52.36,31.95 v51.01,33.3 | JP1.1 33.07,3.07 31.72,4.41 27.28,4.41 24.97,6.87 24.97,12.23 23.31,13.74 23.31,21.32 | 23.31,21.32 23.23,21.4 | 23.31,21.32 v23.31,21.24 | 23.31,21.32
SCK  (via drill 0.6)
  Top 0.4: 29.02,50.77 J1.6 | 29.02,50.77 28.94,50.77 | ICSP.3 62.36,26.38 62.36,21.79 63.51,21.16 65.18,21.16 66.57,19.73 66.57,16.86 62.78,13.74 56.74,13.74 55.39,12.35 55.39,7.82 55.02,7.45 v54.72,7.75 | 44.82,43.94 v44.74,44.34 29.02,44.34 | 29.02,44.34 29.02,50.77 | R7.2 25.7,43.08 26.96,44.34 29.02,44.34
  Bottom 0.4: v44.74,44.34 44.82,39.22 36.25,30.6 36.25,23.14 32.51,19.49 32.51,14.09 33.63,12.82 40.06,12.82 41.4,11.48 41.4,10.92 41.46,10.87 BVALUE.19 41.55,10.78 41.64,10.68 41.4,10.44 41.4,8.38 41.97,7.81 41.97,7.75 v54.72,7.75
VCC  (via drill 0.7)
  Top 0.8: 5.05,17.19 4.88,17.02 IC4.2 | 4.02,15.92 4.01,15.92 v3.86,15.92
  Top 1: 3.74,17.22 IC4.2 | SV1.1 3.74,22.87 3.74,17.22 | 3.74,17.22 5.05,14.93 5.05,15.05 | C7.+ 17.27,8.35 17.27,13.54 16.48,14.33 7.99,14.33 arc90 v7.67,14.01 arc90 v7.67,14.01 v7.67,14.02
  other vias: 3.86,21.64 5.77,21.64 3.86,19.73 5.77,19.73 7.67,19.73 5.77,15.92 3.86,17.83 5.77,17.83 7.67,17.83 7.67,15.92 5.77,14.02 3.86,14.02 7.67,21.64
  pour Top (isolate 0.4, no thermals): 3.11,24.58 5.92,24.58 5.92,31.79 8.78,31.79 8.78,26.87 11.2,26.87 11.2,23.53 11.24,23.57 11.24,11.35 3.11,11.32
  pour Bottom (isolate 0.4, rank 2, no thermals): 2.59,24.81 2.59,13.38 13.39,13.38 13.39,2.75 21.01,2.75 21.01,24.81
VCC3V0  (via drill 0.8)
  Top 0.3: C8.1 20.99,45.38 19.56,44.32 IC1.17
  Top 0.8: C8.1 21.05,46.23 21.05,46.36 21.88,46.32 v22.91,46.36 | v30.21,2.66 30.21,4.09 31.17,5.05 34.82,5.05 35.61,4.25 35.61,2.74 JP1.2
  Bottom 0.8: v30.21,2.66 30.13,2.51 29.42,2.66 16.16,2.66 14.65,4.17 14.65,10.52 13.06,12.11 2.91,12.11 1.16,13.85 1.08,13.93 1.12,46.32 2.11,47.31 21.8,47.43 v22.91,46.36
VIN  (via drill 0.8)
  Top 0.8: JP1.6 48.03,2.55 v48.07,2.59 | D1.C 19.46,13.81 15.98,17.28 15.98,17.86 15.9,17.94 C5.2 15.51,17.97 13.08,20.4 12.21,20.4 IC4.3
  Top 1: 37.35,6.82 37.48,6.94 v37.48,6.95 37.48,6.99 | 37.48,6.99 37.57,6.99 | 25.75,6.99 C6.+ 25.69,7.89 25.6,7.98 20.92,7.98 19.65,9.25 19.65,11.87 D1.C | 25.75,6.99 37.48,6.99 | 25.75,6.99 25.75,6.91
  Bottom 0.8: v48.07,2.59 48.07,4.49 47.28,5.28 39.5,5.28 v37.48,6.95

### Text on the board
Top: PCB by | WestfW
Bottom: Bottom
tPlace: 13 | USB | EXT | RESET | 3.3V
tNames: 3 2 1 0 9 8 | 7 6 5 4 3 2 1 0 | RX | TX | 1 1 1 1 | Digital | AREF | GND | PWM | PWM | PWM | PWM | PWM | PWM | Freeduino | V1.16 | 1 | Analog in | 5V Gnd 9V | 0 1 2 3 4 5
Edit History: 20070917 WestfW: Move (CC) symbol, use silk_gen to get 5mil widths | 20070916 WestfW: Bump Version to 1.16 | 20070916 WestfW: make 0603, 0805, 1206 layouts more alike | 20070911 WestfW: Now V1.15. Move tracks slightly for shielding | 20070910 WestfW: Change power connector. (yuck!) | 20070908 WestfW: Fix Analog-In silk. Keep traces away from holes. | 20070908 WestfW: Play with silkscreen. Add PWM labels, etc. | 20070908 WestfW: Update sch and filenames to 1.14. Clean up silkscreen | 20070907 WestfW: Reverse USB connector pinout. Add hole for resonator | 20070906 WestfW: Convert SMT parts to 0805 size | 20070906 WestfW: Additional copper for VR heatsink. | 20070906 WestfW: Add in Mounting holes. Additional bypass caps. | 20070904 WestfW: Rotate Crystal for GND Guard Ring, move some caps | 20070903 WestfW: Initial manual Route | 20070900 Daniel: Schematic and initial placement
_tsilk: C8 | C12 | 3 2 1 0 9 8 | 7 6 5 4 3 2 1 0 | RX | TX | 1 1 1 1 | Digital | X2 | AREF | GND | PWM | PWM | PWM | PWM | PWM | PWM | IC1 | R7 | Freeduino | FT232RL | 13 | c | c | R10 | V1.16 | R8 | PWR | TX | C10 | 16Mhz | 1 | F1 | RX | R1 | R9 | C3 | USB | R12 | EXT | C4 | R11 | C2 | Q1 | CRS | ICSP | 1 | RESET | IC4 | C5 | ATMEGA168 | D1 | C9 | C1 | Analog in | C7 | C6 | 5V Gnd 9V | RESET | 3.3V | 0 1 2 3 4 5 | 47u | 47u | DC1